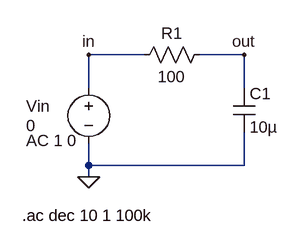
[diagram p0: schematic AC.asc]
AC.asc, the LTspice schematic file:
Version 4
SHEET 1 880 680
WIRE 160 112 80 112
WIRE 304 112 240 112
WIRE 80 160 80 112
WIRE 304 160 304 112
WIRE 80 272 80 240
WIRE 304 272 304 224
WIRE 304 272 80 272
WIRE 80 288 80 272
FLAG 80 288 0
FLAG 80 112 in
FLAG 304 112 out
SYMBOL voltage 80 144 R0
WINDOW 3 -90 70 Left 2
WINDOW 123 -90 92 Left 2
WINDOW 39 0 0 Left 0
WINDOW 0 -90 42 Left 2
SYMATTR Value 0
SYMATTR Value2 AC 1 0
SYMATTR InstName Vin
SYMBOL res 144 128 R270
WINDOW 0 32 56 VTop 2
WINDOW 3 0 56 VBottom 2
SYMATTR InstName R1
SYMATTR Value 100
SYMBOL cap 288 160 R0
SYMATTR InstName C1
SYMATTR Value 10µ
TEXT -16 344 Left 2 !.ac dec 10 1 100k

The netlist it stands for:
* AC.asc
Vin in 0 0 AC 1 0
R1 in out 100
C1 out 0 10µ
.ac dec 10 1 100k
.backanno
.end